# Altium schematic sheet MMC_2_2_PSU.SchDoc
size A4
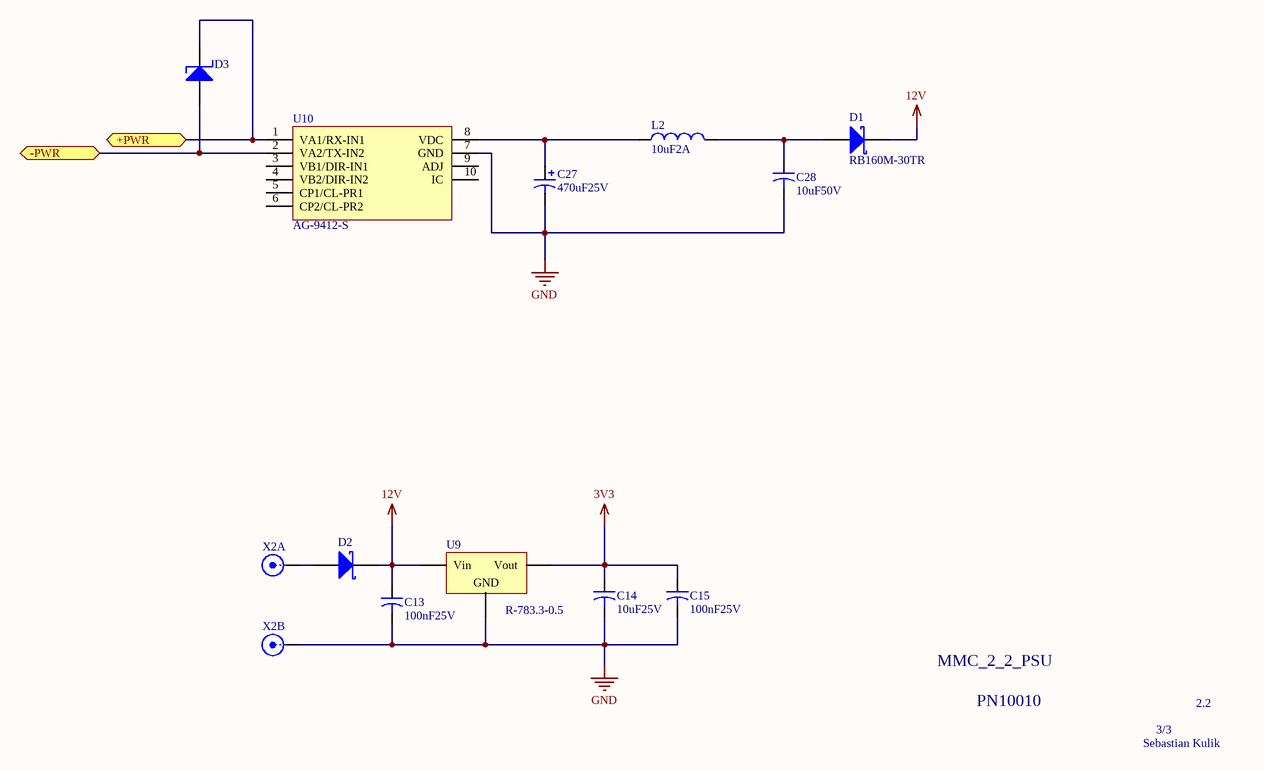
[diagram p0: MMC_2_2_PSU.SchDoc]

## Parts
C13  value 100nF25V  [C0402]  (hidden comment: 100nF25V_0402)
C14  value 10uF25V  [C1210]  (hidden comment: 10uF25V_1210)
C15  value 100nF25V  [C0402]  (hidden comment: 100nF25V_0402)
C27  value 470uF25V  [Panasonic-H13]  (hidden comment: 470uF25V_POL)
C28  value 10uF50V  [C1210]  (hidden comment: 10uF50V_1210)
D1  RB160M-30TR  [SOD123]
D2  SD103AW-V-GS08  [SOD123]  (value not drawn)
D3  SMAJ58A-E3/61  [DO214A]  (value not drawn)
L2  10uF2A  [WE-PD2_1]
U9  R-783.3-0.5  [R-783_3-0_5]
U10  AG-9412-S  [AG-9412-S-1]
X2  PhoenixMSTBA-2  [MSTBA 2,5_2-G-5,08-LR]  (value not drawn)  (parts A,B of 2)

## Ports
+PWR, -PWR

## Nets
3V3: C14.1 C15.1 U9.3(Vout)
12V: C13.1 D1.1(K) D2.1(K) U9.1(Vin)
GND: C13.2 C14.2 C15.2 C27.2 C28.2 U9.2(GND) U10.7(GND) X2.2(Y)
+PWR: D3.1(K) U10.1(VA1/RX-IN1) ; port +PWR
-PWR: D3.2(A) U10.2(VA2/TX-IN2) ; port -PWR
NetC27_1: C27.1 L2.1 U10.8(VDC)
NetC28_1: C28.1 D1.2(A) L2.2
NetD2_2: D2.2(A) X2.1(X)

Not connected (* = marked no-connect by the designer): U10 3(VB1/DIR-IN1) 4(VB2/DIR-IN2) 5(CP1/CL-PR1) 6(CP2/CL-PR2) 9(ADJ) 10(IC)

## Notes on the sheet
- MMC_2_2_PSU
- PN10010
- 3/3
- 2.2
- Sebastian Kulik

## Library data of the parts
C13 C15 = 100nF25V_0402: AVX, X5R, 10%, 25V; Deliverer PartNr: 2280767; Manufacturer PartNr: 04023D104KAT2A; Deliverer: Farnell; TDFE-PN: C0036; Published: 13.02.2014; Part Description: AVX, X5R, 10%, 25V; Publisher: Sebastian Kulik; PackageDescription: C0403; Manufacturer: AVX
C14 = 10uF25V_1210: Capacitor; Part Description: TDK  C series, X5R, 10%, 25V; Deliverer PartNr: 2346957; Manufacturer: TDK; Manufacturer PartNr: C3225X5R1E106K250AA; Deliverer: Farnell; TDFE-PN: C0014; Published: 12.02.2014; Publisher: Sebastian Kulik; PackageDescription: C1210
C27 = 470uF25V_POL: Panasonic, TG series; Deliverer PartNr: 2282114; Manufacturer PartNr: EEV-TG1E471Q; Deliverer: Farnell; TDFE-PN: C0038; Published: 17.02.2014; Part Description: Panasonic, TG series; Publisher: Sebastian Kulik; Manufacturer: Panasonic
C28 = 10uF50V_1210: AVX,  X7R, 10%, 50V; Deliverer PartNr: 2094047RL; Manufacturer PartNr: 12105C106KAT2A; Deliverer: Farnell; TDFE-PN: C0039; Published: 17.02.2014; Part Description: AVX,  X7R, 10%, 50V; Publisher: Sebastian Kulik; PackageDescription: C1210; Manufacturer: AVX
D1 = RB160M-30TR: Diode Schottky,2A,40V; Deliverer PartNr: 1525480; Manufacturer: Rohm; TDE-PN: DIS0010; Deliverer: Farnell; Published: 17.02.2014; PackageReference: SOD123; Publisher: Sebastian Kulik; PackageDescription: SOD123; Manufacturer PartNr: RB160M-30TR
D2 = SD103AW-V-GS08: Diode Schottky,2A,40V; Deliverer PartNr: 1617720RL; Manufacturer: Vishay; TDE-PN: DIS0008; Deliverer: Farnell; Published: 12.02.2014; PackageReference: TO-220AC; Publisher: Sebastian Kulik; PackageDescription: SOD123; Manufacturer PartNr: SD103AW-V-GS08
D3 = SMAJ58A-E3/61: TVS, 400W, 58V; Deliverer PartNr: 1837053; Manufacturer: Vishay; TDE-PN: DIS0009; Deliverer: Farnell; Published: 17.02.2014; PackageReference: DO214AC; Publisher: Sebastian Kulik; PackageDescription: DO214AC; Manufacturer PartNr: SMAJ58A-E3/61
L2 = 10uF2A_WE-PD2: WE-PD2, 10uF2A; Deliverer PartNr: 1636035; Manufacturer: WE; Manufacturer PartNr: 74477510; Deliverer: Farnell; TDE-PN: P0017; Published: 17.02.2014; Publisher: Sebastian Kulik; Value: 10uF2A
U9 = Recom-R-783_3-0_5: Voltage Regulator; Manufacturer: Recom; Deliverer PartNr: 532-8044; TDE-PN: IC0032; Deliverer: RS-Components; Published: 12.02.2014; Manufacturer PartNr: R-783.3-0.5; PackageReference: D2PAK; Publisher: Sebastian Kulik
U10 = AG-9412-S: PoE, 12V; Manufacturer: Silvertel; TDE-PN: IC0038; Published: 17.02.2014; Deliverer PartNr: -; Deliverer: -; PackageReference: TSSOP8; Publisher: Sebastian Kulik; Manufacturer PartNr: AG-9412-S
X2 = PhoenixMSTBA-2: Deliverer PartNr: 2315182; Manufacturer PartNr: MSTBA 2,5/ 2-G-5,08-LR; Manufacturer: Phoenix Contact; Deliverer: Farnell; TDE-PN: CON0006; LatestRevisionDate: 13.03.2014; LatestRevisionNote: Re-released for DXP Platform.; Publisher: Sebastian Kulik